# Altium schematic sheet remote.SchDoc: Electric Skateboard Remote
size A; Revision: 0.0.1; SheetNumber: 1
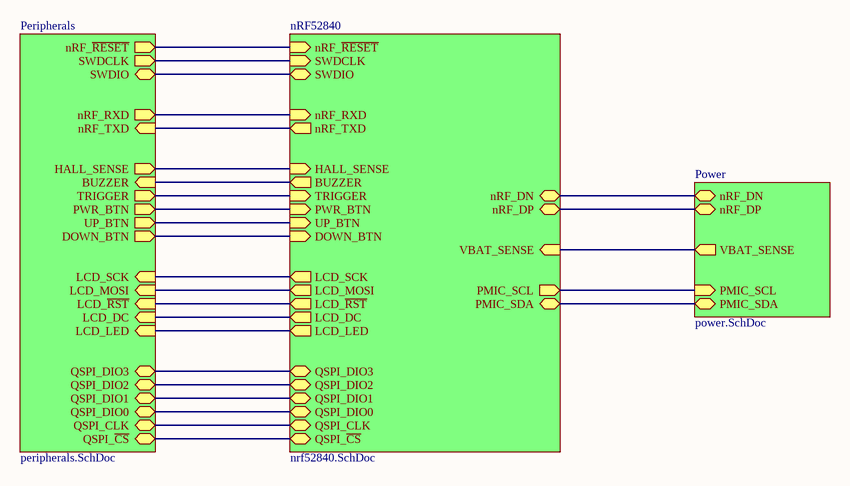
[diagram p0: remote.SchDoc]

## Sub-sheets
nRF52840 = nrf52840.SchDoc: nRF_RXD (in), UP_BTN (in), QSPI_DIO1 (bidir), QSPI_~{CS} (bidir), DOWN_BTN (in), BUZZER (out), nRF_~{RESET} (in), SWDIO (bidir), LCD_DC (out), nRF_DN (bidir), QSPI_DIO0 (bidir), LCD_SCK (out), nRF_DP (bidir), QSPI_DIO2 (bidir), QSPI_CLK (bidir), SWDCLK (in), HALL_SENSE (in), LCD_MOSI (out), PWR_BTN (in), TRIGGER (in), LCD_~{RST} (out), QSPI_DIO3 (bidir), nRF_TXD (out), VBAT_SENSE (in), PMIC_SCL (out), PMIC_SDA (bidir), LCD_LED (out)
Peripherals = peripherals.SchDoc: LCD_SCK (in), LCD_MOSI (in), LCD_~{RST} (in), LCD_DC (in), SWDCLK (out), nRF_~{RESET} (out), SWDIO (bidir), nRF_TXD (in), nRF_RXD (out), QSPI_~{CS} (bidir), QSPI_CLK (bidir), QSPI_DIO0 (bidir), QSPI_DIO1 (bidir), QSPI_DIO2 (bidir), QSPI_DIO3 (bidir), LCD_LED (in), BUZZER (in), DOWN_BTN (out), TRIGGER (out), HALL_SENSE (out), PWR_BTN (out), UP_BTN (out)
Power = power.SchDoc: nRF_DP (bidir), nRF_DN (bidir), VBAT_SENSE (out), PMIC_SDA (bidir), PMIC_SCL (in)

## Nets
(unnamed): sheet nRF52840/nRF_RXD, sheet Peripherals/nRF_RXD
(unnamed): sheet nRF52840/UP_BTN, sheet Peripherals/UP_BTN
(unnamed): sheet nRF52840/QSPI_DIO1, sheet Peripherals/QSPI_DIO1
(unnamed): sheet nRF52840/QSPI_~{CS}, sheet Peripherals/QSPI_~{CS}
(unnamed): sheet nRF52840/DOWN_BTN, sheet Peripherals/DOWN_BTN
(unnamed): sheet nRF52840/BUZZER, sheet Peripherals/BUZZER
(unnamed): sheet nRF52840/nRF_~{RESET}, sheet Peripherals/nRF_~{RESET}
(unnamed): sheet nRF52840/SWDIO, sheet Peripherals/SWDIO
(unnamed): sheet nRF52840/LCD_DC, sheet Peripherals/LCD_DC
(unnamed): sheet nRF52840/nRF_DN, sheet Power/nRF_DN
(unnamed): sheet nRF52840/QSPI_DIO0, sheet Peripherals/QSPI_DIO0
(unnamed): sheet nRF52840/LCD_SCK, sheet Peripherals/LCD_SCK
(unnamed): sheet nRF52840/nRF_DP, sheet Power/nRF_DP
(unnamed): sheet nRF52840/QSPI_DIO2, sheet Peripherals/QSPI_DIO2
(unnamed): sheet nRF52840/QSPI_CLK, sheet Peripherals/QSPI_CLK
(unnamed): sheet nRF52840/SWDCLK, sheet Peripherals/SWDCLK
(unnamed): sheet nRF52840/HALL_SENSE, sheet Peripherals/HALL_SENSE
(unnamed): sheet nRF52840/LCD_MOSI, sheet Peripherals/LCD_MOSI
(unnamed): sheet nRF52840/PWR_BTN, sheet Peripherals/PWR_BTN
(unnamed): sheet nRF52840/TRIGGER, sheet Peripherals/TRIGGER
(unnamed): sheet nRF52840/LCD_~{RST}, sheet Peripherals/LCD_~{RST}
(unnamed): sheet nRF52840/QSPI_DIO3, sheet Peripherals/QSPI_DIO3
(unnamed): sheet nRF52840/nRF_TXD, sheet Peripherals/nRF_TXD
(unnamed): sheet nRF52840/VBAT_SENSE, sheet Power/VBAT_SENSE
(unnamed): sheet nRF52840/PMIC_SCL, sheet Power/PMIC_SCL
(unnamed): sheet nRF52840/PMIC_SDA, sheet Power/PMIC_SDA
(unnamed): sheet nRF52840/LCD_LED, sheet Peripherals/LCD_LED